# EAGLE design LiPo_Lademodul (EAGLE 7.3.0)

## Sheet 1 of 2
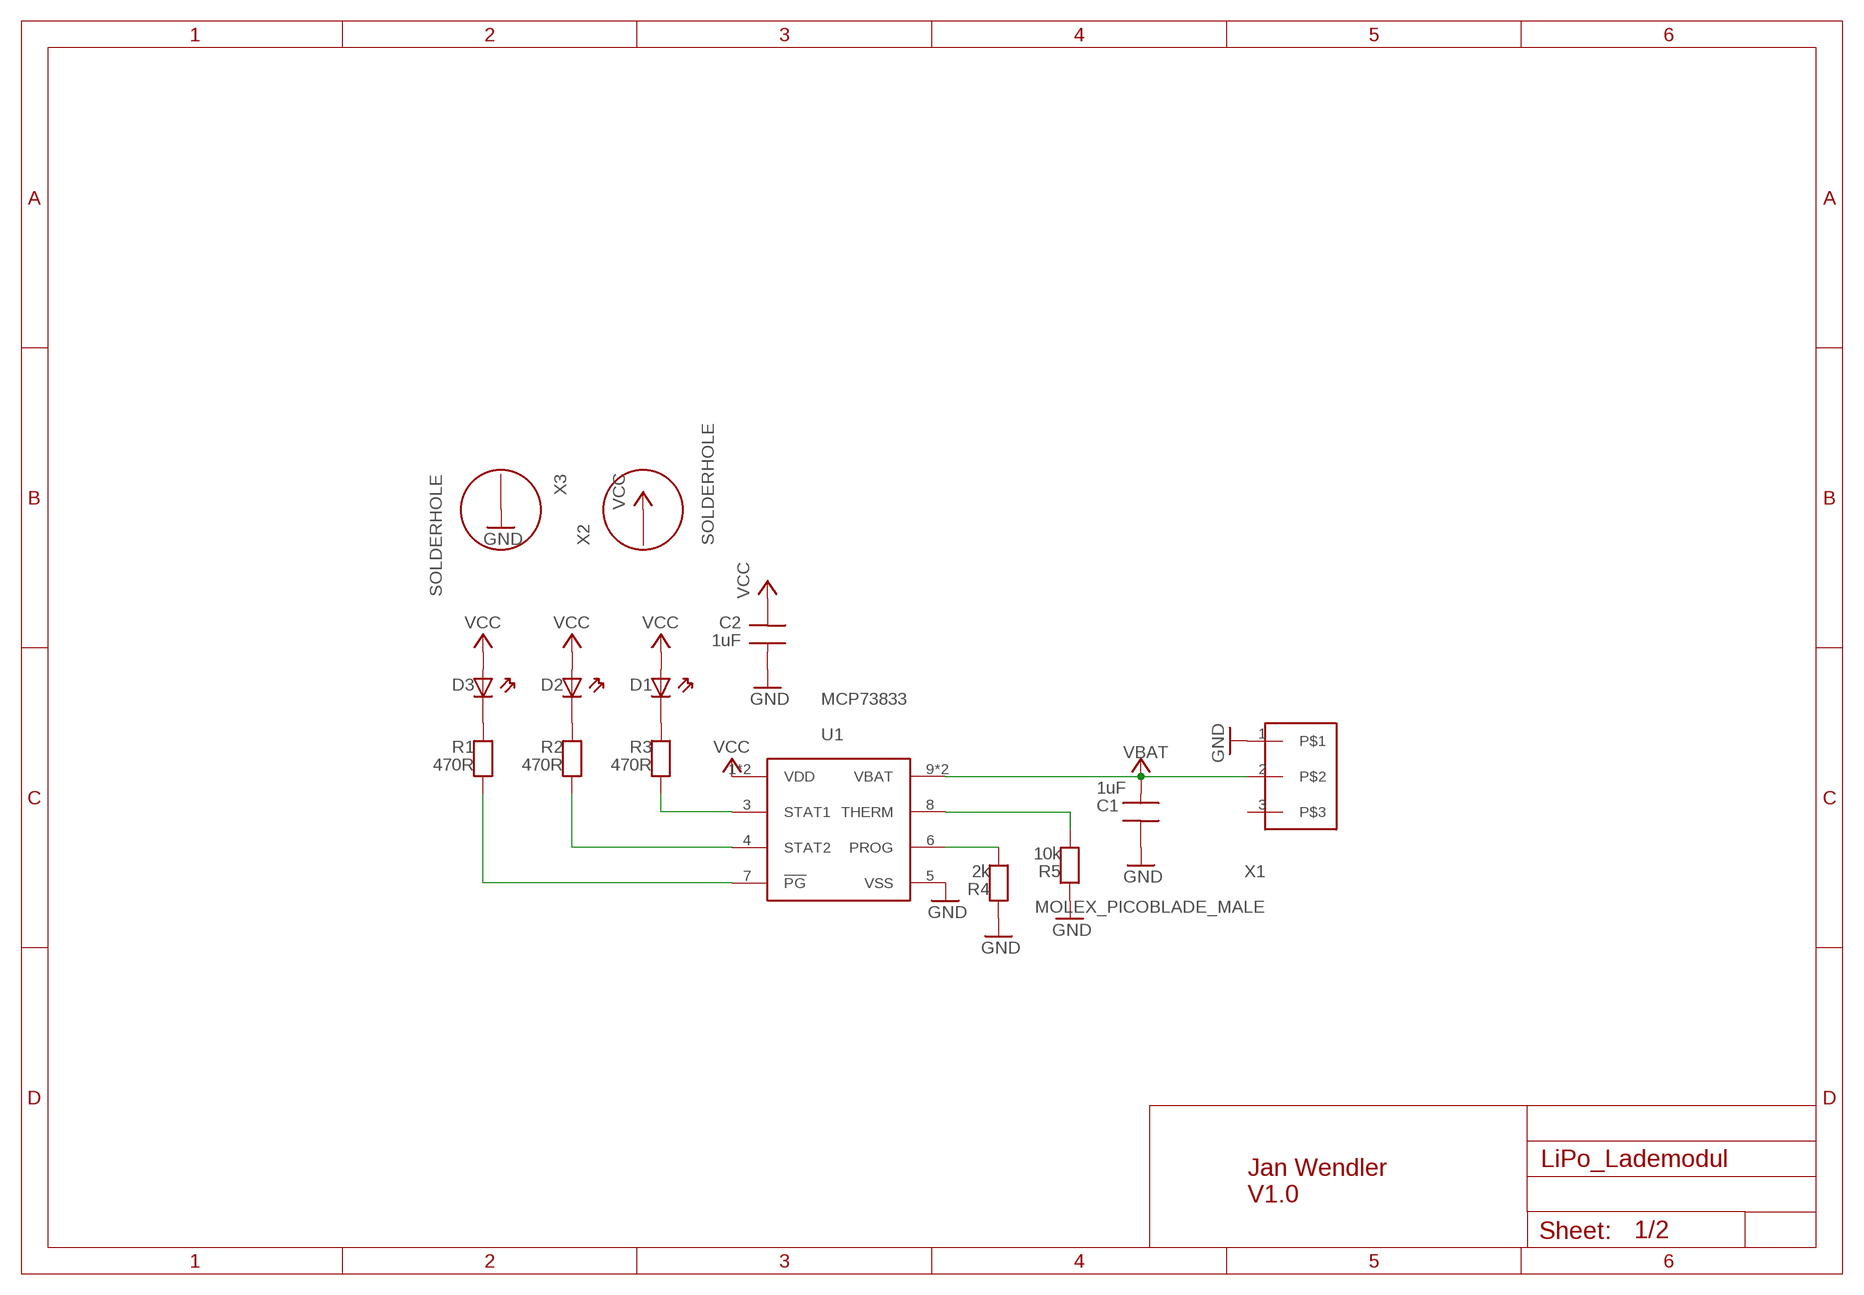
[diagram p0: schematic, sheet 1]

### Parts
C1  1uF  C0603  [0603]
C2  1uF  C0603  [0603]
D1  D0603  [0603]
D2  D0603  [0603]
D3  D0603  [0603]
R1  470R  R0603  [0603]
R2  470R  R0603  [0603]
R3  470R  R0603  [0603]
R4  2k  R0603  [0603]
R5  10k  R0603  [0603]
U1  MCP73833  [MSOP10]
X1  MOLEX_PICOBLADE_MALE  [MOLEX_PICOBLADE_MALE]
X2  SOLDERHOLE  [HOLE_2MM]
X3  SOLDERHOLE  [HOLE_2MM]

### Nets
GND: C1.2 C2.1 R4.1 R5.1 U1.5(VSS) X1.1 X3.P$1
N$1: D1.2(KATHODE) R3.2
N$2: D2.2(KATHODE) R2.2
N$3: D3.2(KATHODE) R1.2
N$4: R4.2 U1.6(PROG)
N$6: R5.2 U1.8(THERM)
N$7: R3.1 U1.3(STAT1)
N$8: R2.1 U1.4(STAT2)
N$9: R1.1 U1.7(!PG!)
VBAT: C1.1 U1.9(VBAT) U1.10(VBAT) X1.2
VCC: C2.2 D1.1(ANODE) D2.1(ANODE) D3.1(ANODE) U1.1(VDD) U1.2(VDD) X2.P$1
Unconnected: X1.3

### Notes on the sheet
- Jan Wendler
  V1.0

## Sheet 2 of 2

## Library data of the parts
C1 C2 = LiPo_Lader:C0603: Capacitor 0603
D1-D3 = LiPo_Lader:D0603: SMD LED 0603
R1-R5 = LiPo_Lader:R0603: Resistor 0603
U1 = LiPo_Lader:MCP73833: MCP73833 Digikey: MCP73833T-AMI/UNCT-ND
X1 = LiPo_Lader:MOLEX_PICOBLADE_MALE
X2 X3 = LiPo_Lader:SOLDERHOLE

## Board
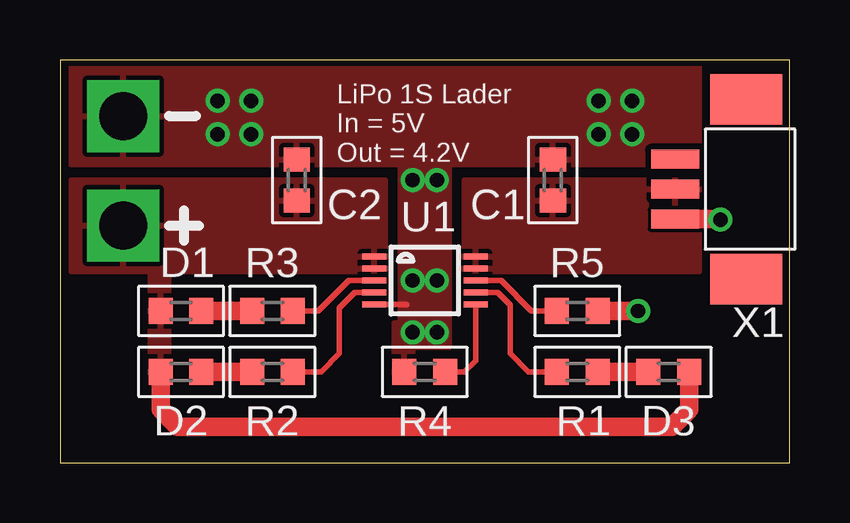
[diagram p1: board, top side]
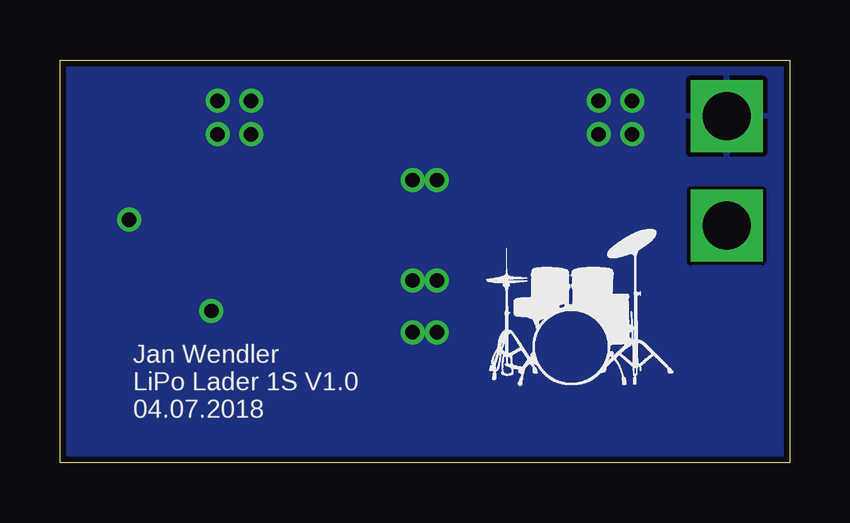
[diagram p2: board, bottom side, seen from below]

Size 30.4 x 16.8 mm. Coordinates in mm from the lower left corner, seen from the top.
Outline: 0,0 30.4,0 30.4,16.8 0,16.8 0,0
Copper layers (1*16): Top 0.018mm / dielectric 1.55mm / Bottom 0.018mm
Design rules "eC_2Layer_PClass6_BaseCopperO18_eCDefault *": minimum track width 0.15mm, minimum drill 0.35mm, track to track 0.15mm, track to pad 0.15mm, pad to pad 0.15mm, via to via 0.15mm, smd to smd 0mil, copper to edge 0.25mm, drill to drill 0.35mm, minimum pad ring 0.175mm, minimum via ring 0.125mm, stop-mask expansion 0mil, vias tented up to drill 0.45mm, thermal gap 0.2mm

### Footprints (pad centres in the part's own frame; a part is rotated, then mirrored left to right if it is on the bottom)
0603 = smd 1 x 1.1: 1 -0.85,0; 2 0.85,0
MSOP10 = smd 0.25 x 1: 1 -1,-2.113; 2 -0.5,-2.113; 3 0,-2.113; 4 0.5,-2.113; 5 1,-2.113; 6 1,2.113; 7 0.5,2.113; 8 0,2.113; 9 -0.5,2.113; 10 -1,2.113
MOLEX_PICOBLADE_MALE = smd 0.8 x 2: 1 -1.25,1.25; 2 0,1.25; 3 1.25,1.25 | smd 2.1 x 3: P$4 -3.75,-1.7; P$5 3.75,-1.7
HOLE_2MM = drill 2 square: P$1 0,0

### Placement (x,y rotation side)
C1  20.53,11.79 90 top
C2  9.87,11.79 270 top
D1  5.04,6.33 0 top
D2  5.04,3.79 0 top
D3  25.36,3.79 180 top
R1  21.55,3.79 0 top
R2  8.85,3.79 180 top
R3  8.85,6.33 180 top
R4  15.2,3.79 0 top
R5  21.55,6.33 180 top
U1  15.2,7.6 270 top
X1  26.88,11.41 90 top
X2  2.63,9.89 0 top
X3  2.63,14.46 0 top

### Tracks (layer width: path | path; a pad name or v marks a point on that pad's centre or on a via)
GND  (via drill 0.6 pad 1)
  Top 0.229: U1.5 14.42,6.6 14.44,6.58
  Top 0.762: R5.1 v24.09,6.33 | X1.1 27.5,10.16 v27.52,10.14
  other vias: 6.56,15.09 7.96,15.09 6.56,13.7 7.96,13.7 22.44,15.09 22.44,13.7 23.84,15.09 23.84,13.7 14.69,11.79 15.71,11.79 14.69,7.6 15.71,7.6 14.69,5.44 15.71,5.44
  pour Bottom: -0.93,17.12 -0.93,-0.66 33.23,-0.27 33.23,17.12
  pour Top (isolate 0.254): 14.69,3.41 13.93,3.41 13.93,5.82 14.18,5.82 14.18,12.43 0.47,12.43 0.47,16.62 26.63,16.62 26.63,12.43 16.22,12.43 16.22,4.81 14.69,4.81
N$1
  Top 0.762: D1.2 R3.2
N$2
  Top 0.762: D2.2 R2.2
N$3
  Top 0.762: D3.2 R1.2
N$4
  Top 0.229: U1.6 17.31,4.25 16.85,3.79 R4.2
N$6
  Top 0.229: U1.8 18.38,7.6 19.64,6.33 R5.2
N$7
  Top 0.229: U1.3 12.02,7.6 10.75,6.33 R3.1
N$8
  Top 0.229: U1.4 12.29,7.1 11.64,6.46 11.64,4.55 10.88,3.79 R2.1
N$9
  Top 0.229: U1.7 18.24,7.1 18.76,6.58 18.76,4.55 19.52,3.79 R1.1
VBAT
  pour Top: 16.85,7.98 26.63,7.98 26.63,11.79 16.85,11.79
VCC
  Top 0.762: D2.1 4.19,2.23 4.91,1.5 25.49,1.5 26.21,2.23 D3.1
  pour Top: 13.55,7.98 4.53,7.98 4.53,3.41 3.77,3.41 3.77,11.79 13.55,11.79
  pour Top: 4.53,11.79 0.47,11.79 0.47,7.98 4.53,7.98

### Text on the board
tPlace: LiPo 1S Lader / In = 5V / Out = 4.2V
bPlace: Jan Wendler / LiPo Lader 1S V1.0 / 04.07.2018